# Altium schematic sheet Gamepad_Sensors.SchDoc
size A; SheetNumber: 4; SheetTotal: 4
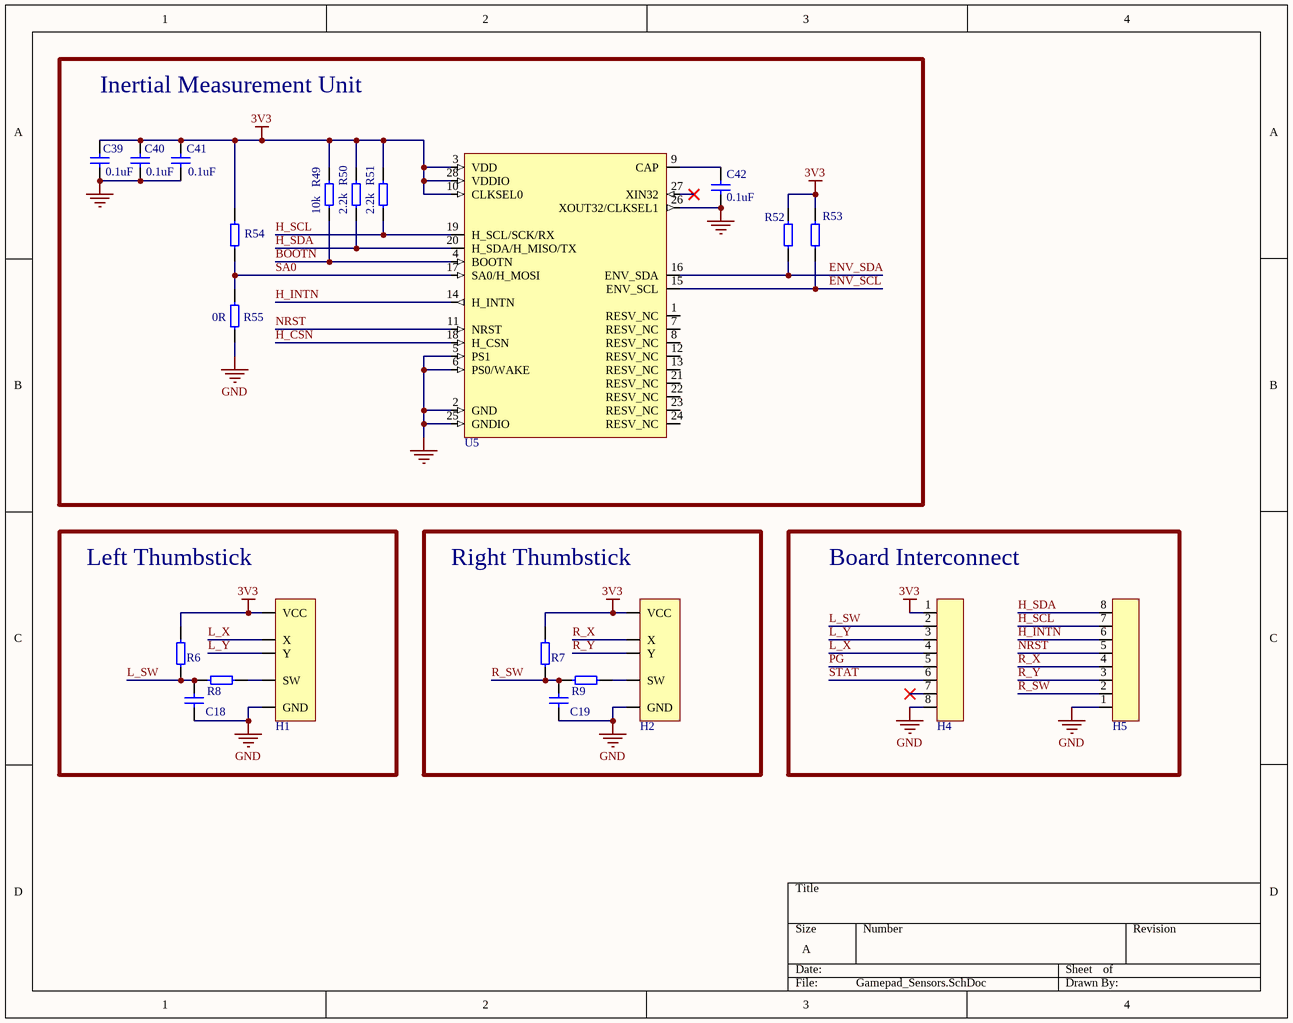
[diagram p0: Gamepad_Sensors.SchDoc]

## Parts
C18  Capacitor  [0603 Capacitor]  (value not drawn)
C19  Capacitor  [0603 Capacitor]  (value not drawn)
C39  0.1uF  [0603 Capacitor]
C40  0.1uF  [0603 Capacitor]
C41  0.1uF  [0603 Capacitor]
C42  0.1uF  [0603 Capacitor]
H1  Left Thumbstick  [THB001P]  (value not drawn)
H2  Right Thumbstick  [THB001P]  (value not drawn)
H4  8x1 Header  [SMD Header Female]  (value not drawn)
H5  8x1 Header  [SMD Header Female]  (value not drawn)
R6  Resistor  [0603 Resistor]  (value not drawn)
R7  Resistor  [0603 Resistor]  (value not drawn)
R8  Resistor  [0603 Resistor]  (value not drawn)
R9  Resistor  [0603 Resistor]  (value not drawn)
R49  10k  [0603 Resistor]
R50  2.2k  [0603 Resistor]
R51  2.2k  [0603 Resistor]
R52  Resistor  [0603 Resistor]  (value not drawn)
R53  Resistor  [0603 Resistor]  (value not drawn)
R54  Resistor  [0603 Resistor]  (value not drawn)
R55  0R  [0603 Resistor]
U5  BNO080  [BNO080]  (value not drawn)

## Blocks framed on the sheet
Inertial Measurement Unit: C39-C42 R49-R55 U5
Left Thumbstick: C18 H1 R6 R8
Right Thumbstick: C19 H2 R7 R9
Board Interconnect: H4 H5

## Nets
3V3: C39.2 C40.1 C41.2 H1.1(VCC) H2.1(VCC) H4.1 R6.2 R7.2 R49.2 R50.2 R51.2 R52.2 R53.2 R54.2 U5.3(VDD) U5.10(CLKSEL0) U5.28(VDDIO)
GND: C18.1 C19.1 C39.1 C40.2 C41.1 C42.1 H1.5(GND) H2.5(GND) H4.8 H5.1 R55.1 U5.2(GND) U5.5(PS1) U5.6(PS0/WAKE) U5.25(GNDIO) U5.26(XOUT32/CLKSEL1)
BOOTN: R49.1 U5.4(BOOTN)
ENV_SCL: R53.1 U5.15(ENV_SCL)
ENV_SDA: R52.1 U5.16(ENV_SDA)
H_CSN: U5.18(H_CSN)
H_INTN: H5.6 U5.14(H_INTN)
H_SCL: H5.7 R51.1 U5.19(H_SCL/SCK/RX)
H_SDA: H5.8 R50.1 U5.20(H_SDA/H_MISO/TX)
L_SW: C18.2 H4.2 R6.1 R8.1
L_X: H1.2(X) H4.4
L_Y: H1.3(Y) H4.3
NRST: H5.5 U5.11(NRST)
PG: H4.5
R_SW: C19.2 H5.2 R7.1 R9.1
R_X: H2.2(X) H5.4
R_Y: H2.3(Y) H5.3
SA0: R54.1 R55.2 U5.17(SA0/H_MOSI)
STAT: H4.6
NetC42_2: C42.2 U5.9(CAP)
NetH1_4: H1.4(SW) R8.2
NetH2_4: H2.4(SW) R9.2

Not connected (* = marked no-connect by the designer): H4 7*; U5 1(RESV_NC) 7(RESV_NC) 8(RESV_NC) 12(RESV_NC) 13(RESV_NC) 21(RESV_NC) 22(RESV_NC) 23(RESV_NC) 24(RESV_NC) 27(XIN32)*

## Library data of the parts
C39-C42 = Capacitor
H1 H2 = Thumbstick
R49-R51 R55 = Resistor
U5 = BNO080: IMU ACCEL/GYRO/MAG I2C 32BIT; Manufacturer 1: Hillcrest Laboratories; Sensor Type: Accelerometer,Gyroscope,Magnetometer; Output Type: SPI,I2C; Supplier 1: Digi-Key; Supplier Part Number 1: 1888-1000-1-ND; Manufacturer Part Number 1: BNO080; RoHS: No; Category: Inertial Measurement Units (IMUs); Mount: Surface Mount; Case/Package: LGA; Min Operating Temperature: -40°C; Max Operating Temperature: 85°C; Packaging: Tape and Reel; ComponentLink1URL: http://www.hillcrestlabs.com/download/5a05f340566d07c196001ec1?src-supplier=Digi-Key; ComponentLink1Description: http://www.hillcrestlabs.com/download/5a05f340566d07c196001ec1?src-supplier=Digi-Key